# Altium project Formation.PrjPcb
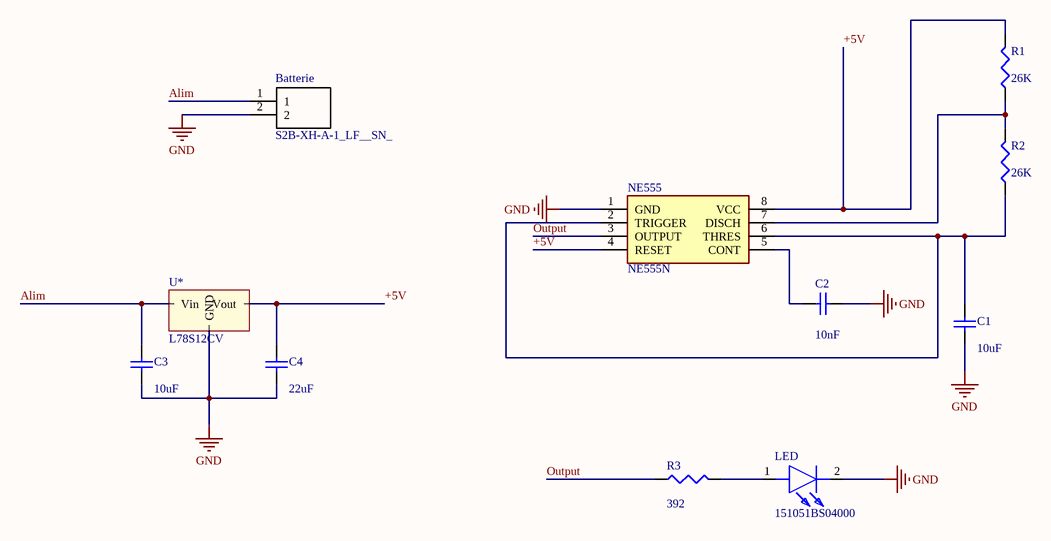
[diagram p0: Schema1.SchDoc]
1 sheet, 11 parts. Net scope: global (net labels, ports and power ports of the same name join across sheets).
Board file: FormationPCB.PcbDoc

## Sheet Schema1.SchDoc
size A4

### Parts
Batterie  S2B-XH-A-1_LF__SN_  [S2B-XH-A]
C1  value 10uF  [C1206]
C2  value 10nF  [C1206]
C3  value 10uF  [C1206]
C4  value 22uF  [C1206]
LED  151051BS04000  [151051BS04000]
NE555  NE555N  [DIP762W56P254L959H533Q8N]
R1  value 26K  [Resistor 1206]
R2  value 26K  [Resistor 1206]
R3  value 392  [Resistor 1206]
U*  L78S12CV  [R-78B]

### Nets
GND: Batterie.2 C1.1 C2.1 C3.2 C4.1 LED.2(K) NE555.1(GND) U*.2(GND)
+5V: C4.2 NE555.4(RESET) NE555.8(VCC) R1.2 U*.1(Vout)
Alim: Batterie.1 C3.1 U*.3(Vin)
Output: NE555.3(OUTPUT) R3.1
NetC1_2: C1.2 NE555.2(TRIGGER) NE555.6(THRES) R2.1
NetC2_2: C2.2 NE555.5(CONT)
NetLED_1: LED.1(A) R3.2
NetNE555_7: NE555.7(DISCH) R1.1 R2.2

### Library data of the parts
Batterie = S2B-XH-A-1_LF__SN_: Connector; Manufacturer_Name: JST (JAPAN SOLDERLESS TERMINALS); Manufacturer_Part_Number: S2B-XH-A-1(LF)(SN); Datasheet Link: http://www.jst-mfg.com/product/pdf/eng/eXH.pdf; Height: 6.1mm; Arrow Part Number: S2B-XH-A-1(LF)(SN)
C1-C4 = Cap Semi: Capacitor (Semiconductor SIM Model); Published: 8-Jun-2000; LatestRevisionDate: 29-May-2009; LatestRevisionNote: IPC-7351 Footprint Added.; PackageReference: C1206; Publisher: Altium Limited; PackageDescription: Chip Capacitor
LED = 151051BS04000: LED; Manufacturer_Name: Wurth Elektronik; Datasheet Link: https://katalog.we-online.de/led/datasheet/151051BS04000.pdf; Height: 8.95mm; Manufacturer_Part_Number: 151051BS04000; Mouser Part Number: 710-151051BS04000; Mouser Price/Stock: https://www.mouser.co.uk/ProductDetail/Wurth-Elektronik/151051BS04000?qs=LlUlMxKIyB3OjuZOlqaOjg%3D%3D
NE555 = NE555N: Integrated Circuit; Manufacturer_Name: HGSEMI; Datasheet Link: https://datasheet.lcsc.com/szlcsc/1906111919_HGSEMI-NE555N_C398063.pdf; Height: 5.33mm; Manufacturer_Part_Number: NE555N
R1-R3 = Res3: Resistor; Published: 8-Jun-2000; LatestRevisionDate: 29-May-2009; LatestRevisionNote: IPC-7351 Footprint Added.; PackageReference: J1-0603; Publisher: Altium Limited; PackageDescription: Chip Resistor
U* = Régulateur de tension linéaire: Vout: *; A: *